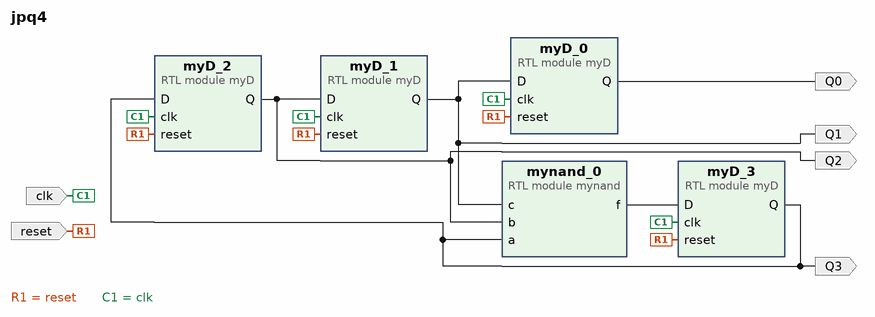
[diagram p0: block diagram of the top level]
# Vivado block design jpq4, xc7a35tcsg324-3, Vivado 2020.1
create_bd_design jpq4

create_bd_port -dir I -type rst reset
create_bd_port -dir I -type clk clk
set_property -dict {CONFIG.ASSOCIATED_RESET reset} [get_bd_ports clk]
create_bd_port -dir O Q0
create_bd_port -dir O Q1
create_bd_port -dir O Q2
create_bd_port -dir O Q3

create_bd_cell -type module -reference myD myD_0
create_bd_cell -type module -reference myD myD_1
create_bd_cell -type module -reference myD myD_2
create_bd_cell -type module -reference myD myD_3
create_bd_cell -type module -reference mynand mynand_0

# ---- connections ----

connect_bd_net -net reset_0_1 [get_bd_ports reset] \
  [get_bd_pins myD_0/reset] [get_bd_pins myD_1/reset] [get_bd_pins myD_2/reset] [get_bd_pins myD_3/reset]
connect_bd_net [get_bd_pins mynand_0/f] [get_bd_pins myD_3/D]
connect_bd_net -net clk_0_1 [get_bd_ports clk] [get_bd_pins myD_0/clk] [get_bd_pins myD_1/clk] [get_bd_pins myD_2/clk] [get_bd_pins myD_3/clk]
connect_bd_net [get_bd_pins myD_0/Q] [get_bd_ports Q0]
connect_bd_net [get_bd_pins myD_1/Q] [get_bd_ports Q1] [get_bd_pins mynand_0/c] [get_bd_pins myD_0/D]
connect_bd_net [get_bd_pins myD_2/Q] [get_bd_ports Q2] [get_bd_pins myD_1/D] [get_bd_pins mynand_0/b]
connect_bd_net [get_bd_pins myD_3/Q] [get_bd_ports Q3] [get_bd_pins myD_2/D] [get_bd_pins mynand_0/a]

validate_bd_design
save_bd_design
